# EAGLE design OBKP_Effector_PCB_MIKE_DID_IT (EAGLE 6.4)
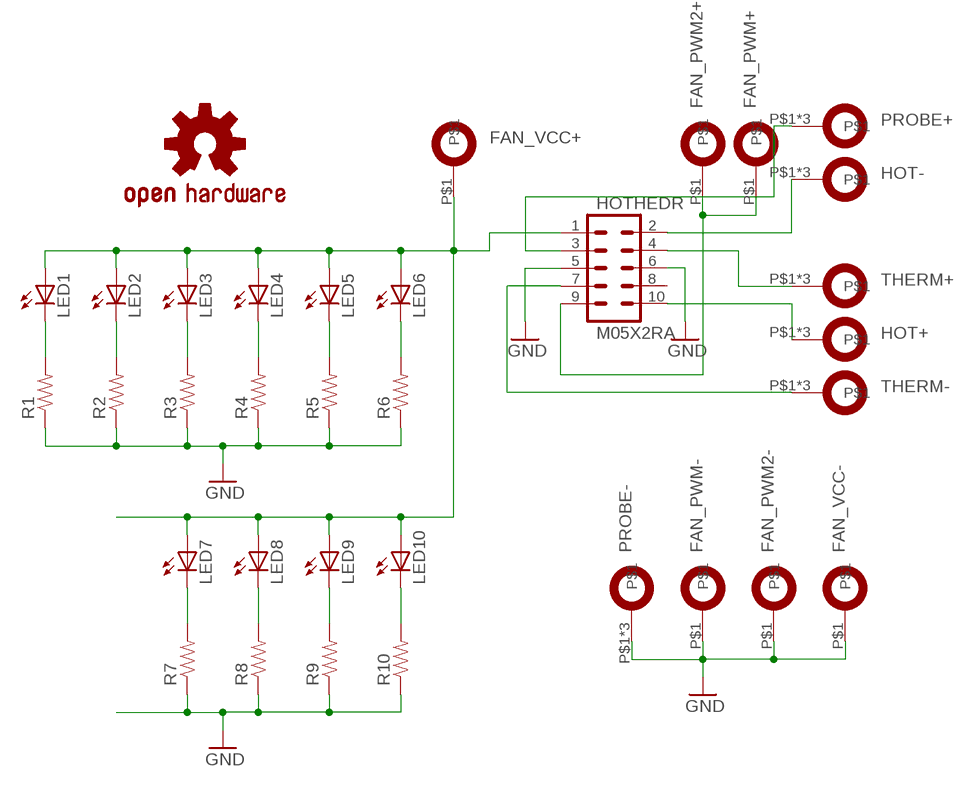
[diagram p0: schematic, sheet 1]

## Parts
FAN_PWM2+  LUG2.3  [2.3MM]
FAN_PWM2-  LUG2.3  [2.3MM]
FAN_PWM+  LUG2.3  [2.3MM]
FAN_PWM-  LUG2.3  [2.3MM]
FAN_VCC+  LUG2.3  [2.3MM]
FAN_VCC-  LUG2.3  [2.3MM]
HOT+  LUG3-X  [3MM]
HOT-  LUG3-X  [3MM]
HOTHEDR  M05X2RA  [2X5-RA]
LED1  LED0805  [CHIPLED_0805]
LED2  LED0805  [CHIPLED_0805]
LED3  LED0805  [CHIPLED_0805]
LED4  LED0805  [CHIPLED_0805]
LED5  LED0805  [CHIPLED_0805]
LED6  LED0805  [CHIPLED_0805]
LED7  LED0805  [CHIPLED_0805]
LED8  LED0805  [CHIPLED_0805]
LED9  LED0805  [CHIPLED_0805]
LED10  LED0805  [CHIPLED_0805]
LOGO1  OSHW-LOGOS  [OSHW-LOGO-S]
PROBE+  LUG3-X  [3MM]
PROBE-  LUG3-X  [3MM]
R1  RESISTOR0805-RES  [0805]
R2  RESISTOR0805-RES  [0805]
R3  RESISTOR0805-RES  [0805]
R4  RESISTOR0805-RES  [0805]
R5  RESISTOR0805-RES  [0805]
R6  RESISTOR0805-RES  [0805]
R7  RESISTOR0805-RES  [0805]
R8  RESISTOR0805-RES  [0805]
R9  RESISTOR0805-RES  [0805]
R10  RESISTOR0805-RES  [0805]
THERM+  LUG3-X  [3MM]
THERM-  LUG3-X  [3MM]

## Nets
FAN_VCC: FAN_VCC+.P$1 HOTHEDR.1 LED1.A LED2.A LED3.A LED4.A LED5.A LED6.A LED7.A LED8.A LED9.A LED10.A
GND: FAN_PWM2-.P$1 FAN_PWM-.P$1 FAN_VCC-.P$1 HOTHEDR.5 HOTHEDR.6 PROBE-.P$1 PROBE-.P$2 PROBE-.P$3 R1.1 R2.1 R3.1 R4.1 R5.1 R6.1 R7.1 R8.1 R9.1 R10.1
N$1: LED1.C R1.2
N$2: LED2.C R2.2
N$3: LED3.C R3.2
N$4: LED4.C R4.2
N$5: LED5.C R5.2
N$6: LED6.C R6.2
N$7: LED7.C R7.2
N$8: HOT-.P$1 HOT-.P$2 HOT-.P$3 HOTHEDR.2
N$9: LED8.C R8.2
N$10: HOT+.P$1 HOT+.P$2 HOT+.P$3 HOTHEDR.10
N$11: HOTHEDR.4 THERM+.P$1 THERM+.P$2 THERM+.P$3
N$12: FAN_PWM2+.P$1 FAN_PWM+.P$1 HOTHEDR.9
N$13: LED9.C R9.2
N$14: LED10.C R10.2
N$19: HOTHEDR.3 PROBE+.P$1 PROBE+.P$2 PROBE+.P$3
N$20: HOTHEDR.7 THERM-.P$1 THERM-.P$2 THERM-.P$3
Unconnected: HOTHEDR.8

## Library data of the parts
FAN_PWM2+ FAN_PWM2- FAN_PWM+ FAN_PWM- FAN_VCC+ FAN_VCC- HOT+ HOT- PROBE+ PROBE- THERM+ THERM- = OBKP_Effector_PCB:LUG
HOTHEDR = SparkFun-Connectors:M05X2: Header 5x2 Standard 10-pin dual row 0.1" header. Commonly used with AVR-ISP. Use with Spark Fun Electronics SKU: PRT-00778
LED1-LED10 = SparkFun-LED:LED: LEDs Standard schematic elements and footprints for 5mm, 3mm, 1206, and 0603 sized LEDs. 5mm - Spark Fun Electronics SKU : COM-00529 (and others)
LOGO1 = SparkFun-Aesthetics:OSHW-LOGO: Open Source Hardware Logo This logo indicates the piece of hardware it is found on incorporates a OSHW license and/or adheres to the definition of open source hardware found here: http://freedomdefined.org/OSHW
R1-R10 = SparkFun-Passives:RESISTOR: Resistor Basic schematic elements and footprints for 0603, 1206, and PTH resistors.

## Net classes
0 default: width 0.203 mm, drill 0.305 mm, clearance 0.203 mm
1 high current: width 0.762 mm, drill 0.457 mm, clearance 0.203 mm

## Board
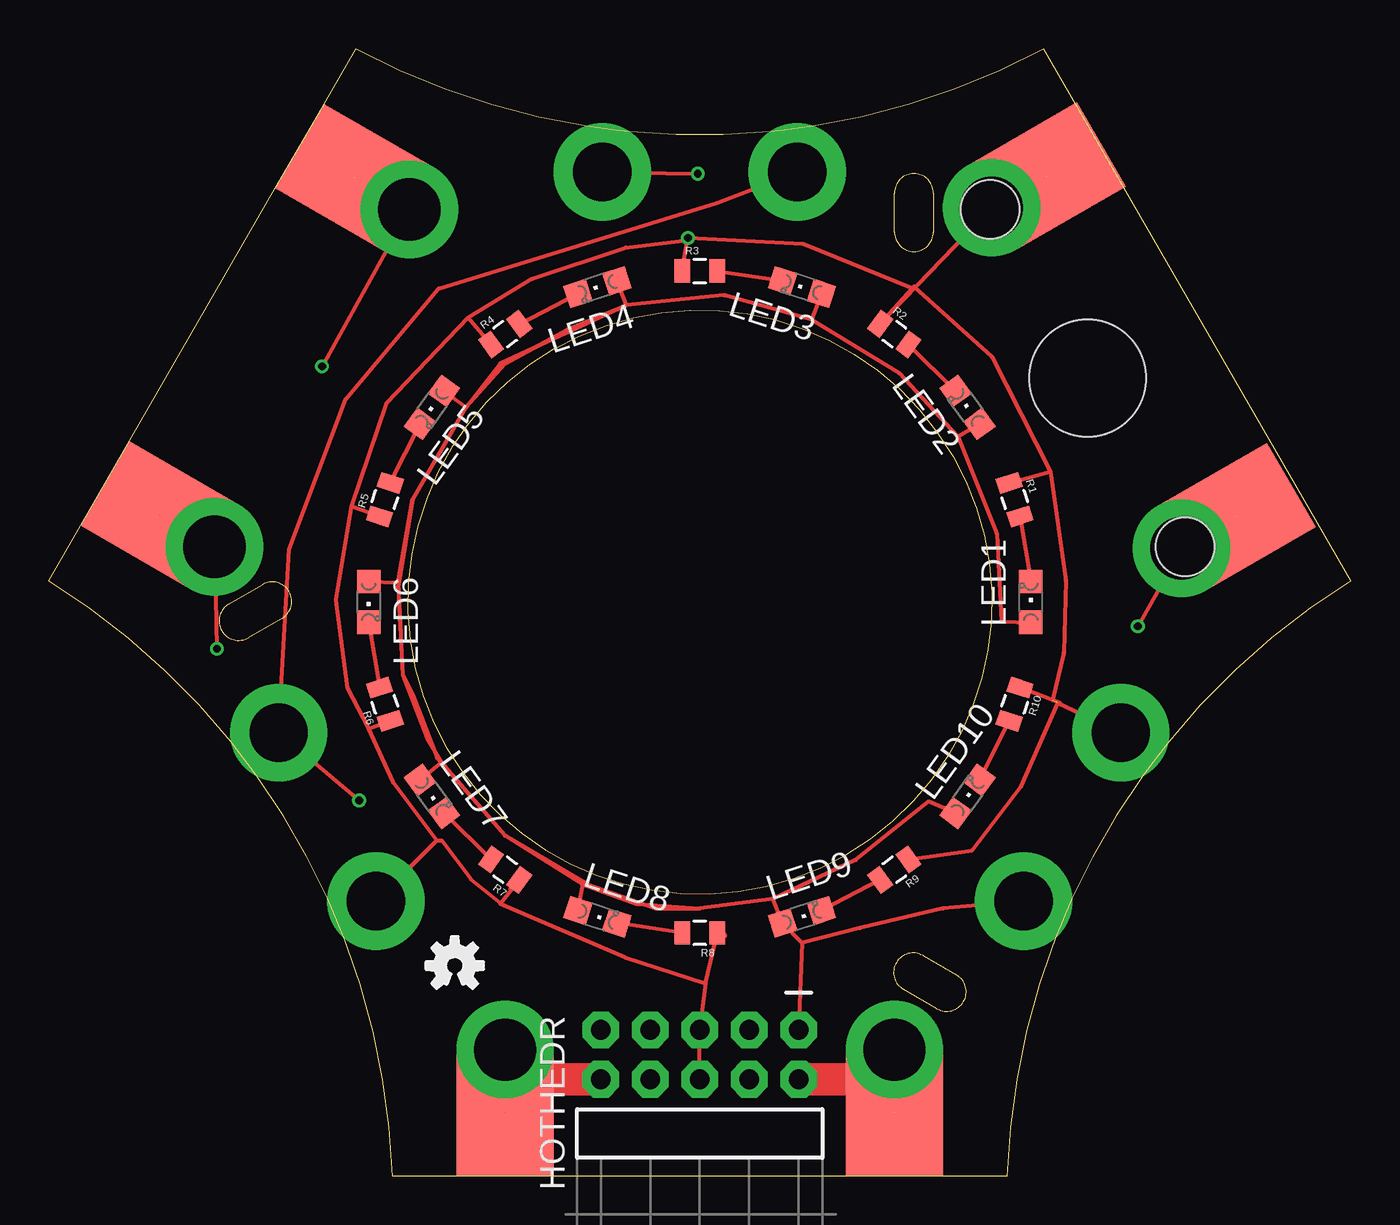
[diagram p1: board, top side]
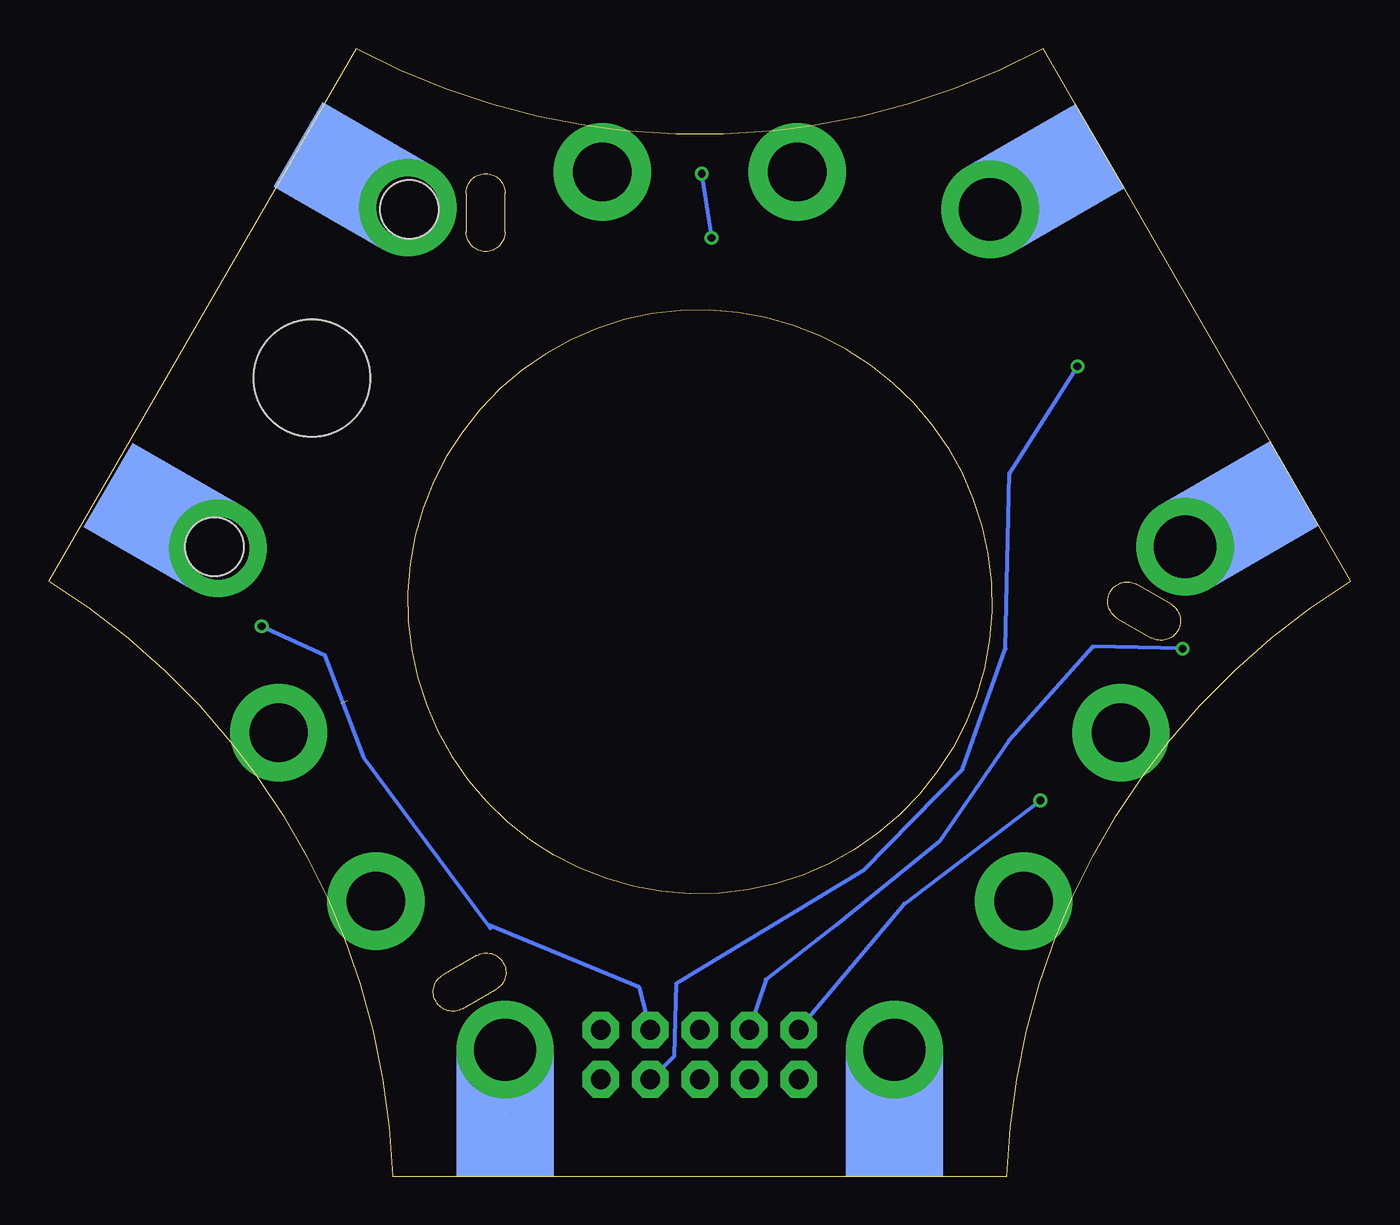
[diagram p2: board, bottom side, seen from below]

Size 66.88 x 57.92 mm. Coordinates in mm from the lower left corner, seen from the top.
Outline: 27.63,53.95 arc-19 15.78,57.92 14.14,55.08 11.64,50.74 1.64,33.42 0,30.58 arc-19 9.36,22.3 arc-3 10.69,20.56 arc-11 14.32,14.27 arc-3 15.17,12.25 arc-19 17.66,0 20.94,0 40.94,0 45.94,0 49.22,0 arc-19 51.71,12.25
Outline: 29.81,53.68 arc11 37.07,53.68
Outline: 27.63,53.95 arc3 29.81,53.68
Outline: 37.07,53.68 arc3 39.24,53.95 arc19 51.1,57.92 66.88,30.58 arc19 57.52,22.3 arc3 56.19,20.55 arc11 52.56,14.27 arc3 51.71,12.25
Outline: 9.25,29.39 arc180 10.25,27.66 11.98,28.66 arc180 10.98,30.39 9.25,29.39
Outline: 44.89,11.34 arc180 43.89,9.61 45.63,8.61 arc180 46.63,10.34 44.89,11.34
Outline: 43.44,48.5 arc180 45.44,48.5 45.44,50.5 arc180 43.44,50.5 43.44,48.5
Outline: 25.94,42.49 arc180 40.94,16.51 arc180 25.94,42.49
Copper layers (1*2*15*16): Top 0.035mm / dielectric 0.2mm / layer 2 0.0175mm / dielectric 1.1mm / layer 15 0.0175mm / dielectric 0.2mm / Bottom 0.035mm
Design rules "SeeedStudio_DRU_no_angle_20130527 *": minimum track width 6mil, minimum drill 12mil, track to track 10mil, track to pad 10mil, pad to pad 10mil, via to via 10mil, smd to smd 0mil, copper to edge 10mil, drill to drill 10mil, minimum pad ring 6mil, minimum via ring 6mil, stop-mask expansion 2mil, vias tented up to drill 25mil, thermal gap 10mil
Holes 3 mm at 58.36,32.34 48.36,49.66
Holes 6 mm at 53.36,41

### Footprints (pad centres in the part's own frame; a part is rotated, then mirrored left to right if it is on the bottom)
2.3MM = drill 3 pad 5: P$1 0,0
3MM = drill 3.2 pad 5: P$1 0,0 | smd 5 x 6.5: P$2 0,-3.25 | smd 5 x 6.5 bottom: P$3 0,-3.25
2X5-RA = drill 1.016 pad 1.88 octagon: 1 -1.27,5.08; 2 1.27,5.08; 3 -1.27,2.54; 4 1.27,2.54; 5 -1.27,0; 6 1.27,0; 7 -1.27,-2.54; 8 1.27,-2.54; 9 -1.27,-5.08; 10 1.27,-5.08
CHIPLED_0805 = smd 1.2 x 1.2: A -1.05,0; C 1.05,0
0805 = smd 0.8 x 1.2: 1 -0.9,0; 2 0.9,0

### Placement (x,y rotation side)
FAN_PWM2+  11.81,22.79 300 top
FAN_PWM2-  16.81,14.13 300 top
FAN_PWM+  38.44,51.59 0 top
FAN_PWM-  28.44,51.59 0 top
FAN_VCC+  50.07,14.13 330 top
FAN_VCC-  55.07,22.79 330 top
HOT+  23.44,6.5 0 top
HOT-  43.44,6.5 0 top
HOTHEDR  33.44,6.25 270 top
LED1  50.44,29.5 90 top
LED2  47.19,39.49 126 top
LED3  38.69,45.67 162 top
LED4  28.19,45.67 198 top
LED5  19.69,39.49 234 top
LED6  16.44,29.5 270 top
LED7  19.69,19.51 306 top
LED8  28.19,13.33 342 top
LED9  38.69,13.33 18 top
LED10  47.19,19.51 54 top
LOGO1  20.85,10.82 0 top
PROBE+  58.19,32.25 120 top
PROBE-  48.44,49.75 120 top
R1  49.61,34.75 288 top
R2  43.43,43.25 324 top
R3  33.44,46.5 0 top
R4  23.45,43.25 36 top
R5  17.27,34.75 72 top
R6  17.27,24.25 108 top
R7  23.45,15.75 144 top
R8  33.44,12.5 180 top
R9  43.43,15.75 216 top
R10  49.61,24.25 252 top
THERM+  18.52,49.66 240 top
THERM-  8.52,32.34 240 top

### Tracks (layer width: path | path; a pad name or v marks a point on that pad's centre or on a via)
FAN_VCC
  Top 0.2: LED8.A 27.44,15 | 27.44,15 30.19,14 33.44,13.75 | 27.44,15 23.44,17.5 | 23.44,17.5 20.19,21.25 | 20.19,21.25 LED7.A | LED6.A 17.94,30.5 | 17.94,30.5 18.19,25.75 | 18.19,25.75 19.44,22.5 20.19,21.25 | 17.94,30.5 18.69,34.75 | LED5.A 21.44,39.5 | 21.44,39.5 23.44,41.75 26.69,43.5 29.69,44.75 | 29.69,44.75 LED4.A | LED3.A 39.19,44 | 39.19,44 34.69,45.25 29.69,44.75 | 46.69,38 43.69,41.25 39.19,44 | LED2.A 46.69,38 | 46.69,38 48.69,33 48.94,28.5 LED1.A | 37.19,14.25 LED9.A 38.69,12 | 37.19,14.25 33.44,13.75 | LED10.A 45.19,19.25 41.44,16.25 37.19,14.25 | FAN_VCC+.P$1 45.94,13.75 41.69,12.75 38.69,12 | 23.44,17.5 19.94,21.5 18.69,24.75 18.19,25.75 | 23.44,17.5 27.69,15 31.19,13.75 33.44,13.75 | 29.69,44.75 23.19,41.75 21.44,39.5 | 21.44,39.5 18.69,34.75 | 18.69,34.75 17.94,30.25 18.19,25.75 | 38.69,12 HOTHEDR.1
GND  (via drill 0.4 pad 0.6)  (2 unrouted)
  Top 0.2: 34.71,12.37 34.69,12.35 | 19.94,17.25 19.93,17.25 FAN_PWM2-.P$1 19.94,17.25 | 19.94,17.25 20.19,17.25 21.69,15.25 23.37,13.92 | 23.71,14.75 R7.1 23.19,14 23.37,13.92 | 19.94,17.25 17.69,20.25 16.44,23 | 16.44,23 R6.1 | R9.1 47.44,16.75 49.94,20 51.84,24.3 | 51.84,24.3 FAN_VCC-.P$1 | 51.84,24.3 51.94,24.3 R10.1 | 23.37,13.92 29.59,11.25 33.74,9.9 | PROBE-.P$3 PROBE-.P$1 R2.1 44.35,45.61 | 33.74,9.9 HOTHEDR.5 HOTHEDR.6 | 33.74,9.9 R8.1 | R5.1 15.54,34.4 | 15.54,34.4 14.74,29.6 15.34,25.1 16.44,23 | R4.1 21.54,44.1 | 21.54,44.1 17.34,39.7 15.54,34.4 | R1.1 51.44,36.2 | 51.44,36.2 52.24,30.6 52.14,26.9 51.56,24.45 | 44.35,45.61 44.44,45.7 48.44,42.1 51.44,36.2 | R3.1 32.82,48.08 | 32.82,48.08 v32.84,48.2 38.74,47.9 44.35,45.61 | 21.54,44.1 24.84,46.1 29.64,47.7 32.82,48.08 | FAN_PWM-.P$1 v33.34,51.5
  Top 0.305: 34.71,12.37 R8.1
  Bottom 0.2: v33.34,51.5 v32.84,48.2
N$1
  Top 0.203: R1.2 LED1.C
N$2
  Top 0.203: R2.2 LED2.C
N$3
  Top 0.203: R3.2 LED3.C
N$4
  Top 0.203: R4.2 LED4.C
N$5
  Top 0.203: R5.2 LED5.C
N$6
  Top 0.203: LED6.C R6.2
N$7
  Top 0.203: R7.2 LED7.C
N$8  (1 unrouted)
  Top 0.2: 41.92,4.98 43.54,6.5 HOT-.P$3
  Top 1.676: HOT-.P$1 41.92,4.98 HOTHEDR.2
N$9
  Top 0.203: R8.2 LED8.C
N$10  (1 unrouted)
  Top 0.2: 24.96,4.98 HOT+.P$3
  Top 1.676: HOT+.P$1 24.96,4.98 HOTHEDR.10
N$11  (via drill 0.4 pad 0.6)  (1 unrouted)
  Top 0.2: THERM+.P$3 18.44,49.5 THERM+.P$1 v14.04,41.6
  Bottom 0.2: HOTHEDR.4 34.74,6.2 34.64,9.9 25.04,15.7 19.94,20.9 17.74,27.1 17.54,36.1 v14.04,41.6
N$12  (via drill 0.4 pad 0.6)
  Top 0.2: v15.94,19.3 FAN_PWM2+.P$1 12.34,32.2 15.24,39.9 20.04,45.6 34.34,50 FAN_PWM+.P$1
  Bottom 0.2: HOTHEDR.9 22.94,14 v15.94,19.3
N$13
  Top 0.203: R9.2 LED9.C
N$14
  Top 0.203: R10.2 LED10.C
N$19  (via drill 0.4 pad 0.6)  (1 unrouted)
  Top 0.2: PROBE+.P$3 PROBE+.P$1 v55.94,28.25
  Bottom 0.2: 44.19,12.75 44.31,12.92 | 44.31,12.92 50.69,21.5 52.69,26.75 v55.94,28.25 | HOTHEDR.3 36.54,9.7 44.31,12.92
N$20  (via drill 0.4 pad 0.6)  (1 unrouted)
  Top 0.2: THERM-.P$3 THERM-.P$1 v8.64,27.1
  Bottom 0.2: v8.64,27.1 13.24,27.2 17.54,22.4 21.14,17.2 26.44,12.9 30.04,10.1 HOTHEDR.7